# Altium schematic sheet [3] USB.SchDoc: ESP32 KIT
size C; DocumentNumber: 3; SheetNumber: 3; SheetTotal: 3
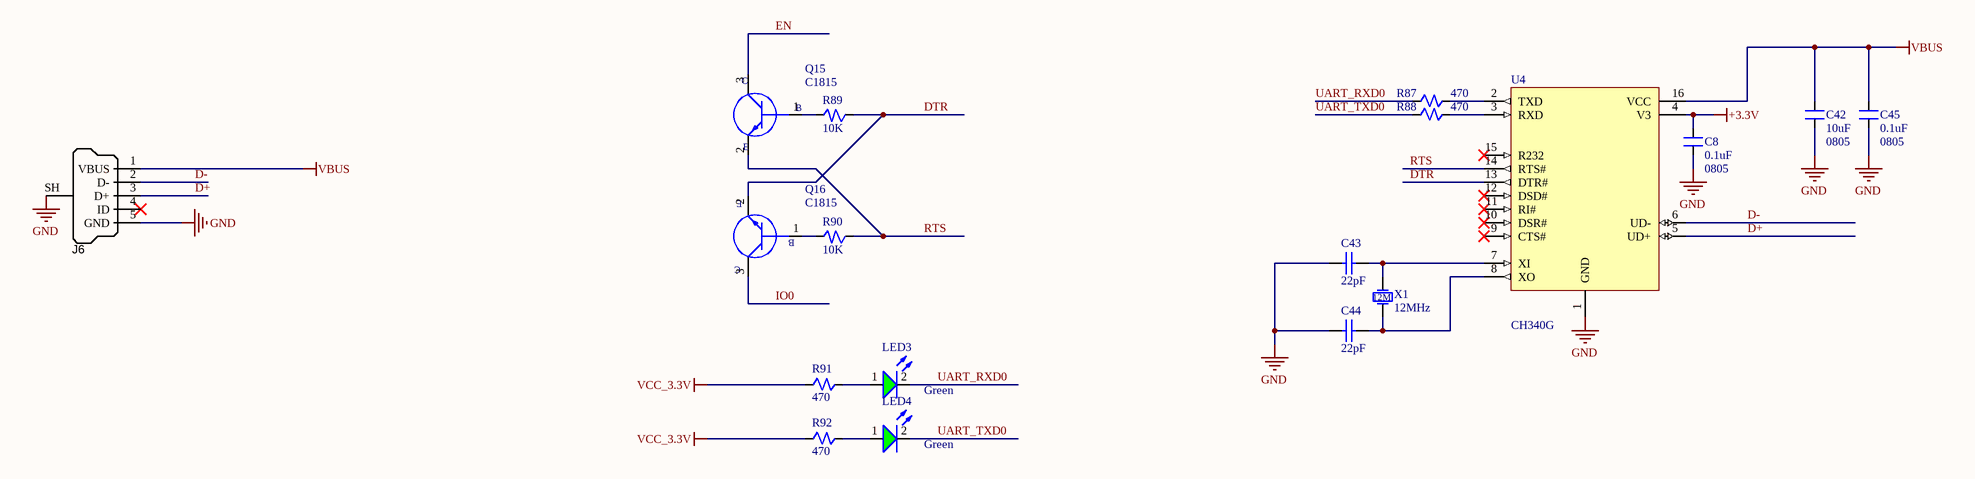
[diagram p0: [3] USB.SchDoc]

## Parts
C8  0.1uF  Package/Case: 0805  [SM-0805]
C42  10uF  Package/Case: 0805  [SM-0805]
C43  22pF  [tu 0805]
C44  22pF  [tu 0805]
C45  0.1uF  Package/Case: 0805  [SM-0805]
J6  USB Micro Type B (recommended if hand soldering)  [USB_Micro-B_FCI_SMD]  (value not drawn)
LED3  value Green  [Led 0805G]  (hidden comment: LED-0805GVC)
LED4  value Green  [Led 0805G]  (hidden comment: LED-0805GVC)
Q15  C1815  [SOT23-132]
Q16  C1815  [SOT23-132]
R87  470  [RES_0805]
R88  470  [RES_0805]
R89  10K  [RES_0805]
R90  10K  [RES_0805]
R91  470  [RES_0805]
R92  470  [RES_0805]
U4  CH340G  [CH340G]
X1  12MHz  [CRYSTAL_ABM3 5x3.2mm]

## Nets
+3.3V: C8.2 U4.4(V3)
GND: C8.1 C42.1 C43.2 C44.1 C45.1 J6.5(GND) J6.SH(Shell) U4.1(GND)
VBUS: C42.2 C45.2 J6.1(VBUS) U4.16(VCC)
VCC_3.3V: R91.1 R92.1
D+: J6.3(D+) U4.5(UD+)
D-: J6.2(D-) U4.6(UD-)
DTR: Q16.2(E) R89.1 U4.13(DTR#)
EN: Q15.3(C)
IO0: Q16.3(C)
RTS: Q15.2(E) R90.1 U4.14(RTS#)
UART_RXD0: LED3.2(K) R87.1
UART_TXD0: LED4.2(K) R88.1
NetC43_1: C43.1 U4.7(XI) X1.1(OSC1)
NetC44_2: C44.2 U4.8(XO) X1.2(OSC2)
NetLED3_1: LED3.1(A) R91.2
NetLED4_1: LED4.1(A) R92.2
NetQ15_1: Q15.1(B) R89.2
NetQ16_1: Q16.1(B) R90.2
NetR87_2: R87.2 U4.2(TXD)
NetR88_2: R88.2 U4.3(RXD)

Not connected (* = marked no-connect by the designer): J6 4(ID)*; U4 9(CTS#)* 10(DSR#)* 11(RI#)* 12(DSD#)* 15(R232)*

## Notes on the sheet
- (in symbol ABM3-12.000MHZ-D2Y-T) 12M

## Library data of the parts
C8 C42 C45 = Cap 0805_1: CAP 0805
C43 C44 = Tu 0805 22pF 50V 10%: Dán; Don_Vi: Con; So_Chan: 2; Ten_Linh_Kien: Tụ 0805 22P 10% 50V; Ma_Hang: MH004560; Chung_Loai: Dán; Kieu_Chan: *
J6 = USB_Micro_TypeB_FCI: Connector SMD-THD USB Micro Type B middle mount; Manufacturer 1: FCI; Manufacturer Part Number 1: 10103593-0001LF; SCDType: undef; Package / Case: SMD/THD mid-mount; Supplier 1: Digi-Key; Supplier Part Number 1: 609-4049-1-ND
LED3 LED4 = LED-0805GVC: LED Green 2mA 3V 0805; ComponentLink1Description: Datasheet; ComponentLink1URL: D:\Dropbox\Datasheets\Opto and Illumination\LEDs\SMD LED.pdf; Unit Price: 0.0476
Q15 Q16 = C1815 SMD: TRANS C1815 SOT23 TRANS NPN 0.15A 50V; Manufacturer: Minh Hà; Voltage: 45V; Supplier 1: Rochester Electronics; Part Number: C1815; Stock 1: 5904000; Pricing 1: 1=0.03, 25=0.03, 100=0.03, 500=0.03, 1000=0.03 (USD); ComponentLink1URL: http://www.farnell.com/datasheets/699988.pdf?src-supplier=Farnell; ComponentLink1Description: http://www.farnell.com/datasheets/699988.pdf?src-supplier=Farnell; ComponentLink2URL: http://www.farnell.com/datasheets/699988.pdf?src-supplier=Newark; ComponentLink2Description: http://www.farnell.com/datasheets/699988.pdf?src-supplier=Newark; ComponentLink3URL: https://www.mouser.com/ds/2/302/BC817_BC817W_BC337-188983.pdf?src-supplier=Mouser; ComponentLink3Description: https://www.mouser.com/ds/2/302/BC817_BC817W_BC337-188983.pdf?src-supplier=Mouser; ComponentLink4URL: https://assets.nexperia.com/documents/data-sheet/BC817_SER.pdf?src-supplier=Digi-Key; ComponentLink4Description: https://assets.nexperia.com/documents/data-sheet/BC817_SER.pdf?src-supplier=Digi-Key; Supplier Part Number 1: BC817-25,215; Current: 0.15A; ComponentLink5Description: Link VN; ComponentLink5URL: https://banlinhkien.com/c1815-sot23-trans-npn-0.15a-50v-hf-10c-p6860580.html
R87 R88 R91 R92 = RES 470R 0805 1% 1/8W: Điện Trở 470 Ohm 0805 1% 1/8W /; Part Number: Trở 0805 1% 470R; Manufacturer: Minh Hà; ComponentLink1Description: Link VN; ComponentLink1URL: https://banlinhkien.com/tro-0805-1-470r-50c-p17823145.html; Package: 0805; Tolerance: 1%; Power: 1/8W
R89 R90 = RES 10K 0805 1% 1/8W: Điện Trở 10 KOhm 0805 1% 1/8W /; Part Number: Trở 0805 1% 10K; Manufacturer: Minh Hà; ComponentLink1Description: Link VN; ComponentLink1URL: https://banlinhkien.com/tro-0805-1-10k-50c-p6651952.html; Package: 0805; Tolerance: 1%; Power: 1/8W
U4 = CH340G: USB to serial chip CH340
X1 = ABM3-12.000MHZ-D2Y-T: CRYSTAL 12.0000MHZ 18pF SMD; Manufacturer: Abracon; Solder: SMT; CompanyID: VT-01247; Cross PN: H130A-12.000-18-2030-EXT-TR; Cross DES: CRYSTAL 12.0000MHZ 18PF SMD 5032 5.00mm x 3.20mm; Cross MNF: Raltron Electronics; Part Number: ABM3-12.000MHZ-D2Y-T; Value: 12MHz; Category: CRYSTAL